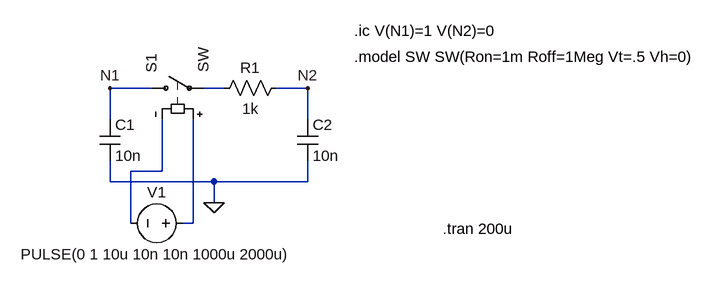
[diagram p0: schematic q1.asc]
q1.asc, the LTspice schematic file:
Version 4
SHEET 1 1012 680
WIRE 176 272 112 272
WIRE 288 272 256 272
WIRE 416 272 368 272
WIRE 112 320 112 272
WIRE 416 320 416 272
WIRE 192 400 192 320
WIRE 192 400 144 400
WIRE 112 416 112 384
WIRE 272 416 112 416
WIRE 416 416 416 384
WIRE 416 416 272 416
WIRE 272 448 272 416
WIRE 144 480 144 400
WIRE 240 480 240 320
WIRE 240 480 224 480
FLAG 272 448 0
FLAG 416 272 N2
FLAG 112 272 N1
SYMBOL cap 96 320 R0
SYMATTR InstName C1
SYMATTR Value 10n
SYMBOL cap 400 320 R0
SYMATTR InstName C2
SYMATTR Value 10n
SYMBOL res 384 256 R90
WINDOW 0 0 56 VBottom 2
WINDOW 3 32 56 VTop 2
SYMATTR InstName R1
SYMATTR Value 1k
SYMBOL sw 160 272 R270
SYMATTR InstName S1
SYMBOL voltage 240 480 R90
WINDOW 0 -32 56 VBottom 2
WINDOW 3 32 56 VTop 2
SYMATTR InstName V1
SYMATTR Value PULSE(0 1 10u 10n 10n 1000u 2000u)
TEXT 488 184 Left 2 !.ic V(N1)=1 V(N2)=0
TEXT 488 224 Left 2 !.model SW SW(Ron=1m Roff=1Meg Vt=.5 Vh=0)
TEXT 624 488 Left 2 !.tran 200u

The netlist it stands for:
* q1.asc
C1 N1 0 10n
C2 N2 0 10n
R1 N2 N001 1k
S1 N1 N001 N003 N002 SW
V1 N003 N002 PULSE(0 1 10u 10n 10n 1000u 2000u)
.ic V(N1)=1 V(N2)=0
.model SW SW(Ron=1m Roff=1Meg Vt=.5 Vh=0)
.tran 200u
.backanno
.end